# EAGLE design v2.1 Power (EAGLE 9.7.0)
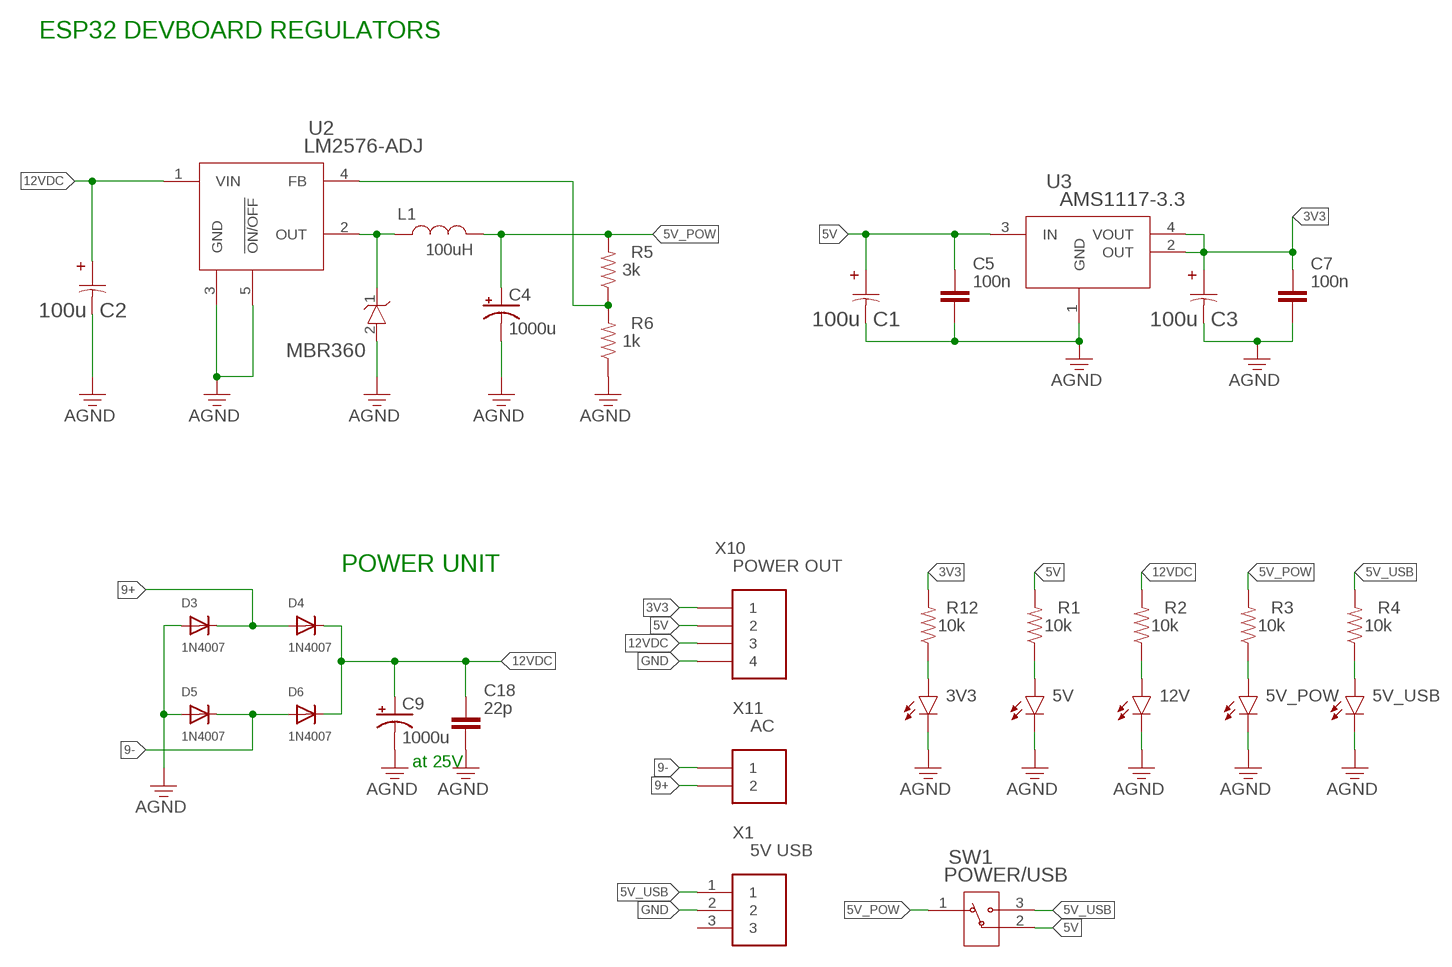
[diagram p0: schematic, sheet 1]

## Parts
3V3  LED  CHIP-FLAT-B_0805  [LEDC2012X110N_FLAT-B]
5V  LED  CHIP-FLAT-B_0805  [LEDC2012X110N_FLAT-B]
5V_POW  LED  CHIP-FLAT-B_0805  [LEDC2012X110N_FLAT-B]
5V_USB  LED  CHIP-FLAT-B_0805  [LEDC2012X110N_FLAT-B]
12V  LED  CHIP-FLAT-B_0805  [LEDC2012X110N_FLAT-B]
C1  100u  100UF_CAPCAP_YX_6P3X11_RUB  [100UF_CAP]
C2  100u  100UF_CAPCAP_YX_6P3X11_RUB  [100UF_CAP]
C3  100u  100UF_CAPCAP_YX_6P3X11_RUB  [100UF_CAP]
C4  1000u  CAP_10X20INCAP_10X20IN  [CAP_10X20IN]
C5  100n  C_CHIP-0805(2012-METRIC)  [CAPC2012X110]
C7  100n  C_CHIP-0805(2012-METRIC)  [CAPC2012X110]
C9  1000u  CAP_10X20INCAP_10X20IN  [CAP_10X20IN]
C18  22p  C_CHIP-0805(2012-METRIC)  [CAPC2012X110]
D3  1N4007  DIODE_SOD-123FL  [SOD-123FL]
D4  1N4007  DIODE_SOD-123FL  [SOD-123FL]
D5  1N4007  DIODE_SOD-123FL  [SOD-123FL]
D6  1N4007  DIODE_SOD-123FL  [SOD-123FL]
L1  100uH  100UH_INDIND_MURATA_2200_MUR  [IND_MURATA_2200_MUR]
MBR360  MBR360RLGDO-201AD_ONS  [DO-201AD_ONS]
R1  10k  R-US_CHIP-0805(2012-METRIC)  [RESC2012X65]
R2  10k  R-US_CHIP-0805(2012-METRIC)  [RESC2012X65]
R3  10k  R-US_CHIP-0805(2012-METRIC)  [RESC2012X65]
R4  10k  R-US_CHIP-0805(2012-METRIC)  [RESC2012X65]
R5  3k  R-US_CHIP-0805(2012-METRIC)  [RESC2012X65]
R6  1k  R-US_CHIP-0805(2012-METRIC)  [RESC2012X65]
R12  10k  R-US_CHIP-0805(2012-METRIC)  [RESC2012X65]
SW1  POWER/USB  SL_SWITCHSS-12D10G5_XKB  [SS-12D10G5_XKB]
U2  LM2576-ADJ  LM2576-ADJT05A_TEX  [T05A_TEX]
U3  AMS1117-3.3  AMS1117-3.3_ADS-L  [_ADS-L]
X1  5V USB  JST-XH-03-PIN-LONG-PAD  [JST-XH-03-PACKAGE-LONG-PAD]
X10  POWER OUT  JST-XH-04-PIN-LONG-PAD  [JST-XH-04-PACKAGE-LONG-PAD]
X11  AC  JST-XH-02-PIN-LONG-PAD  [-LONG-PAD]

## Nets
3V3: C3.1 C7.1 R12.2 U3.2(OUT) U3.4(VOUT) X10.1
5V: C1.1 C5.1 R1.2 SW1.2 U3.3(IN) X10.2
5V_POW: C4.1(+) L1.1 R3.2 R5.2 SW1.1
5V_USB: R4.2 SW1.3 X1.1
9+: D3.C D4.A X11.2
9-: D5.C D6.A X11.1
12VDC: C2.1 C9.1(+) C18.1 D4.C D6.C R2.2 U2.1(VIN) X10.3
FB: R5.1 R6.2 U2.4(FB)
GND: 3V3.C 5V.C 5V_POW.C 5V_USB.C 12V.C C1.2 C2.2 C3.2 C4.2(-) C5.2 C7.2 C9.2(-) C18.2 D3.A D5.A MBR360.2(ANODE) R6.1 U2.3(GND) U2.5(!ON/OFF) U3.1(GND) X1.2 X10.4 ; supply symbol labelled AGND
N$1: 5V.A R1.1
N$2: L1.2 MBR360.1(CATHODE) U2.2(OUT)
N$3: 12V.A R2.1
N$4: 5V_POW.A R3.1
N$5: 5V_USB.A R4.1
N$6: 3V3.A R12.1
Unconnected: X1.3

## Notes on the sheet
- ESP32 DEVBOARD REGULATORS
- POWER UNIT
- at 25V

## Library data of the parts
3V3 5V 5V_POW 5V_USB 12V = LED:CHIP-FLAT-B: Blue LED - Generic; CATEGORY: LED; COLOR: Blue; DESCRIPTION: Blue LED Indication 0805 (2012 Metric); PACKAGE_SIZE: 0805; PACKAGE_TYPE: SMD; SUBCATEGORY: Chip LED; TYPE: Square with Flat Top
C1-C3 = SD-SolderSync-Library:100UF_CAP; COPYRIGHT: Copyright (C) 2025 Ultra Librarian. All rights reserved.; MANUFACTURER_PART_NUMBER: 35ZLH100MEFC6.3X11; MFR_NAME: Rubycon
C4 C9 = SD-SolderSync-Library:CAP_10X20IN; COPYRIGHT: Copyright (C) 2025 Ultra Librarian. All rights reserved.; MANUFACTURER_PART_NUMBER: UVR1E102MPD; MFR_NAME: Nichicon
C5 C7 C18 = Capacitor:C: Capacitor - Generic; CATEGORY: Capacitor; PACKAGE_SIZE: 0805; PACKAGE_TYPE: SMD; SUBCATEGORY: Ceramic Capacitors; TYPE: MLCC
D3-D6 = adafruit:DIODE: Diode SMADIODE - SMA Surface Mount Package 20V 1A Schottky Diode Digikey: 641-1014-6-ND DO-1N4148 - Through Hole Small Current Diode SOD-123 20V 1 A (.5mV Vf) Schottky Diode - Digikey: MBRX120TPMSCT-ND SOD-323 10V 570mA (.38mV Vf, 3ns) Schottky Diode - Digikey: ZLLS410CT-ND SOD-523 30V 30mA Schottky Diode (RB751S-40TE61) - Digikey: RB751S-40TE61CT-ND SOT23-R/W - SOT23 Package (R = Solder Paste/Reflow Ovens, W = Hand-Soldering) BAT54Film 40V 300mA - Digikey: 497-7162-1-ND
L1 = SD-SolderSync-Library:100UH_IND; COPYRIGHT: Copyright (C) 2025 Ultra Librarian. All rights reserved.; MANUFACTURER_PART_NUMBER: 22R104C; MFR_NAME: Murata
MBR360 = SD-SolderSync-Library:MBR360RLG; COPYRIGHT: Copyright (C) 2025 Ultra Librarian. All rights reserved.; MANUFACTURER_PART_NUMBER: MBR360RLG; MFR_NAME: onsemi
R1-R6 R12 = Resistor:R-US: Resistor Fixed - ANSI; CATEGORY: Resistors; DESCRIPTION: Chip Resistor 2.00 X 1.25 X 0.65 mm body 0805(2012-METRIC) Package; PACKAGE_SIZE: 0805; PACKAGE_TYPE: SMD
SW1 = SD-SolderSync-Library:SL_SWITCH; COPYRIGHT: Copyright (C) 2025 Ultra Librarian. All rights reserved.; MANUFACTURER_PART_NUMBER: SS-12D10G5; MFR_NAME: XKB Connectivity
U2 = SD-SolderSync-Library:LM2576-ADJ; COPYRIGHT: Copyright (C) 2025 Ultra Librarian. All rights reserved.; MANUFACTURER_PART_NUMBER: LM2576HVT-ADJ/NOPB; MFR_NAME: Texas Instruments
U3 = SD-SolderSync-Library:AMS1117-3.3; COPYRIGHT: Copyright (C) 2024 Ultra Librarian. All rights reserved.; MANUFACTURER_PART_NUMBER: AMS1117-3.3; MFR_NAME: Advanced Monolithic Systems
X1 = Connectors:JST-XH-03-PIN: JST XH Connector 2 Pin Wire to board connector. Pitch: 2,54 mm, (0.100") Number of pins: 3 Created by Rembrandt Electronics www.rembrandtelectronics.com
X10 = Connectors:JST-XH-04-PIN: JST XH Connector 2 Pin Wire to board connector. Pitch: 2,54 mm, (0.100") Number of pins: 4 Created by Rembrandt Electronics www.rembrandtelectronics.com
X11 = Connectors:JST-XH-02-PIN: JST XH Connector 2 Pin Wire to board connector. Pitch: 2,54 mm, (0.100") Number of pins: 2 Created by Rembrandt Electronics www.rembrandtelectronics.com

## Board
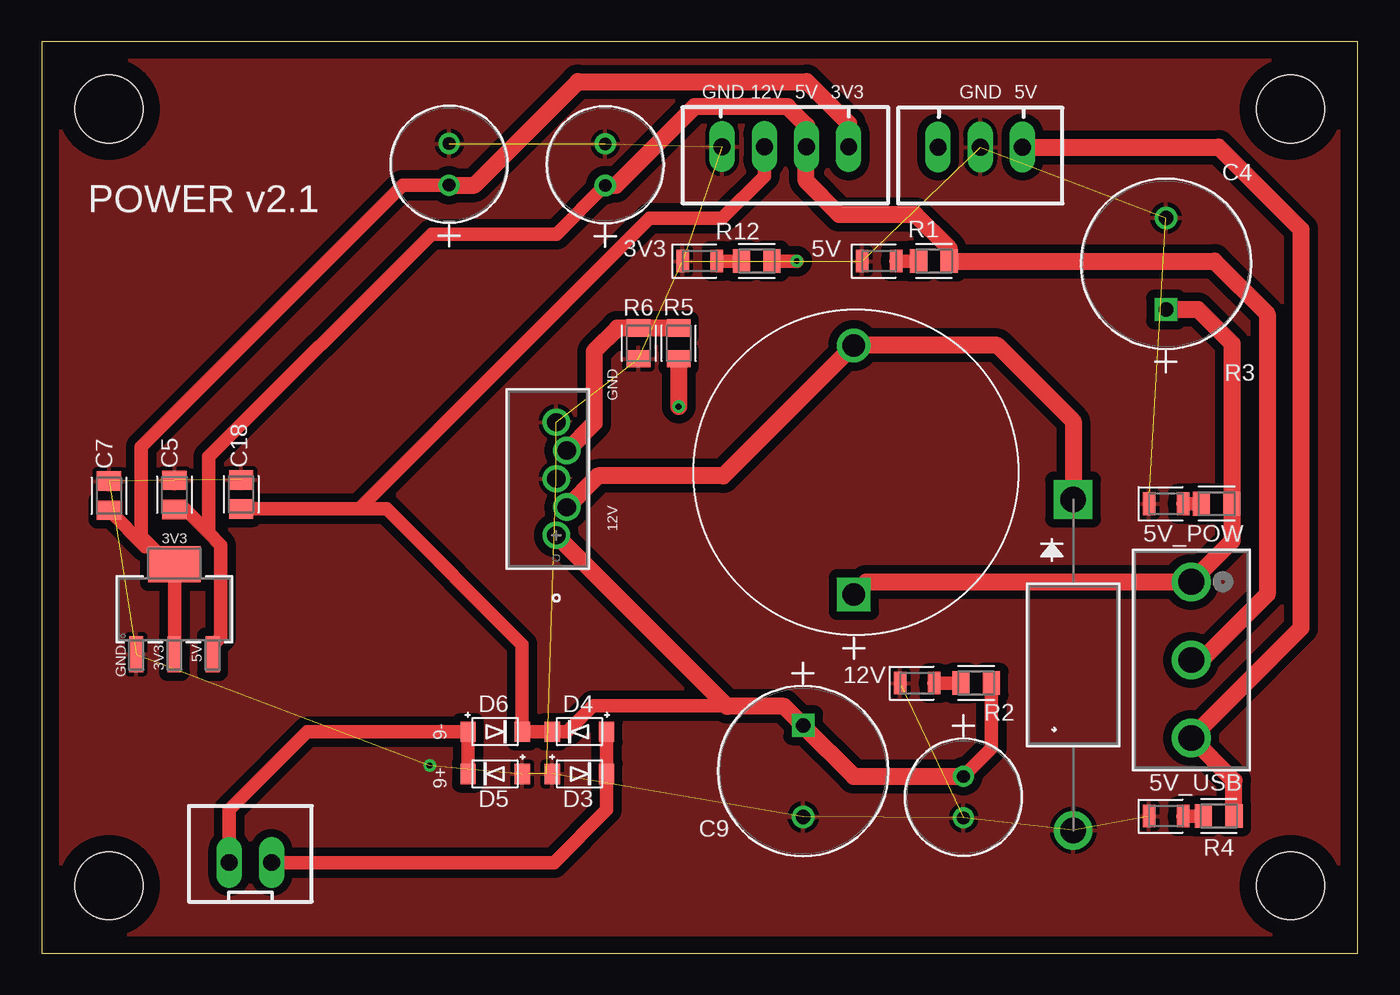
[diagram p1: board, top side]
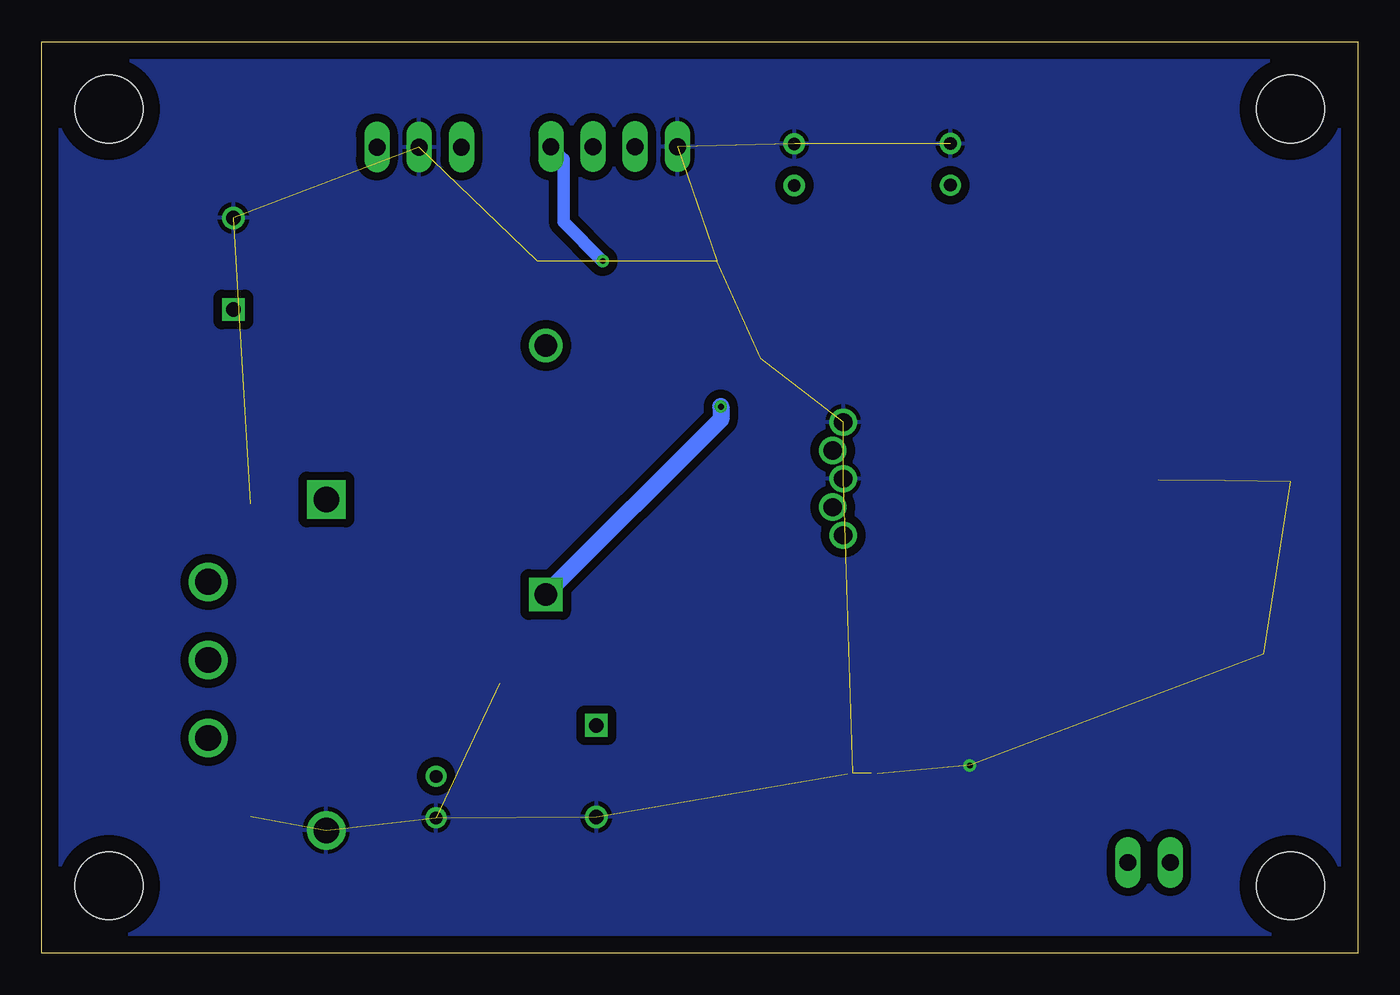
[diagram p2: board, bottom side, seen from below]

Size 79.25 x 54.86 mm. Coordinates in mm from the lower left corner, seen from the top.
Outline: 0,0 79.25,0 79.25,54.86 0,54.86 0,0
Copper layers (1*16): Top 0.035mm / dielectric 1.5mm / Bottom 0.035mm
Design rules "Fusion Electronics Design Rules": minimum track width 6mil, minimum drill 0.35mm, track to track 6mil, track to pad 6mil, pad to pad 6mil, via to via 6mil, smd to smd 6mil, copper to edge 40mil, drill to drill 6mil, minimum pad ring 10mil, minimum via ring 8mil, stop-mask expansion 4mil, vias tented up to drill 0mil, thermal gap 10mil
Holes 4.06 mm at 4.06,4.06 75.18,4.06 4.06,50.8 75.18,50.8

### Footprints (pad centres in the part's own frame; a part is rotated, then mirrored left to right if it is on the bottom)
LEDC2012X110N_FLAT-B = smd 0.762 x 1.362: A 1.025,0; C -1.025,0
100UF_CAP = drill 0.762 pad 1.27: 1 0,0; 2 2.5,0
CAP_10X20IN = drill 0.864 pad 1.372 square: 1 0,0 | drill 0.864 pad 1.372: 2 5.512,0
CAPC2012X110 = smd 1.165 x 1.465: 1 -0.875,0; 2 0.875,0
SOD-123FL = smd 0.91 x 1.22: A 1.637,0; C -1.637,0
IND_MURATA_2200_MUR = drill 1.346 pad 1.854 square: 1 0,0 | drill 1.346 pad 1.854: 2 14.986,0
DO-201AD_ONS = drill 1.549 pad 2.057 square: 1 0,0 | drill 1.549 pad 2.057: 2 19.914,0
RESC2012X65 = smd 1.031 x 1.42: 1 -0.919,0; 2 0.919,0
SS-12D10G5_XKB = drill 1.549 pad 2.057: 1 0,0; 2 4.699,0; 3 9.398,0
T05A_TEX = drill 1.092 pad 1.6: 1 0,0; 2 1.702,-0.635; 3 3.404,0; 4 5.105,-0.635; 5 6.807,0
_ADS-L = smd 0.838 x 2.184: 1 -2.29,-2.705; 2 0,-2.705; 3 2.29,-2.705 | smd 3.15 x 2.184: 4 0,2.705
JST-XH-03-PACKAGE-LONG-PAD = drill 1.016 long: 1 -2.54,0; 2 0,0; 3 2.54,0
JST-XH-04-PACKAGE-LONG-PAD = drill 1.016 long: 1 -3.81,0; 2 -1.27,0; 3 1.27,0; 4 3.81,0
-LONG-PAD = drill 1.016 long: 1 -1.27,0; 2 1.27,0

### Placement (x,y rotation side)
3V3  39.62,41.66 0 top
5V  50.42,41.66 0 top
5V_POW  67.69,27.05 0 top
5V_USB  67.69,8.25 0 top
12V  52.7,16.26 0 top
C1  33.93,46.2 90 top
C2  55.5,10.64 270 top
C3  24.54,46.23 90 top
C4  67.69,38.73 90 top
C5  8,27.58 90 top
C7  4.06,27.53 90 top
C9  45.85,13.72 270 top
C18  12.01,27.61 90 top
D3  32.39,10.8 180 top
D4  32.39,13.34 0 top
D5  27.3,10.8 0 top
D6  27.3,13.34 180 top
L1  48.89,21.59 90 top
MBR360  62.1,27.3 270 top
R1  53.72,41.66 0 top
R2  56.26,16.26 0 top
R3  70.74,27.05 0 top
R4  70.87,8.25 0 top
R5  38.35,36.7 270 top
R6  35.94,36.7 90 top
R12  43.05,41.66 0 top
SW1  69.22,22.35 270 top
U2  30.99,25.15 90 top
U3  8,20.7 0 top
X1  56.52,48.51 180 top
X10  44.78,48.54 180 top
X11  12.57,5.46 0 top

### Tracks (layer width: path | path; a pad name or v marks a point on that pad's centre or on a via)
3V3  (via drill 0.35)
  Top 0.813: U3.2 U3.4 7.7,23.41 6.25,24.86 | 6.25,24.86 5.99,25.11 5.99,30.48 21.74,46.23 C3.1 | C7.1 6.25,24.47 6.25,24.86 | R12.2 v45.47,41.66
  Top 1.016: C3.1 26.06,46.23 32.28,52.45 46.08,52.45 48.59,49.94 X10.1
  Bottom 0.762: X10.1 47.83,47.78 47.83,44.02 v45.47,41.66
5V
  Top 0.813: 10.05,25.29 10.8,24.55 10.8,19.01 10.29,18.5 U3.3 | 10.05,25.29 8.64,26.71 C5.1 | C1.1 31.01,43.28 23.47,43.28 10.05,29.86 10.05,25.29
  Top 1.016: C1.1 34.57,46.2 39.32,50.95 44.91,50.95 46.05,49.81 X10.2 46.03,48.54 46.03,46.49 48.02,44.45 52.61,44.45 54.64,42.42 R1.2 70.61,41.66 73.79,38.48 73.79,21.59 69.85,17.65 SW1.2
5V_POW  (via drill 0.35)
  Top 1.016: C4.1 69.63,38.73 71.66,36.7 R3.2 71.66,24.8 SW1.1 49.66,22.35 L1.1 | R5.2 v38.35,32.89
  Bottom 1.016: v38.35,32.89 38.35,32.13 L1.1
5V_USB
  Top 1.016: R4.2 71.78,10.38 SW1.3 75.82,19.56 75.82,43.56 70.87,48.51 X1.1
9+
  Top 0.813: D4.A D3.C 34.02,8.62 30.86,5.46 X11.2
9-
  Top 0.813: D5.C D6.A 16,13.34 11.3,8.64 X11.1
12VDC
  Top 0.813: C9.1 44.68,14.89 33.19,14.89 31.64,13.34 D4.C D6.C 28.94,18.57 20.78,26.73 C18.1 19.13,26.73 36.61,44.22 40.97,44.22 43.51,46.76 X10.3 | R2.2 57.18,12.32 C2.1
  Top 1.016: C2.1 48.89,10.64 45.85,13.69 C9.1 44.7,14.86 41.28,14.86 U2.1
FB
  Top 1.016: R5.1 R6.2 34.67,37.62 33.27,36.23 33.27,31.9 U2.4
GND  (via drill 0.35)  (22 unrouted)
  Top 0.254: D5.A 29.25,10.8 29.3,10.84 | 30.39,10.84 30.44,10.8 D3.A
  other vias: 23.37,11.3
  pour Top (isolate 0.508): -0.38,-0.38 79.81,-0.38 79.81,55.24 -0.38,55.24
  pour Bottom (isolate 0.508): -0.89,-0.76 80.42,-0.76 80.42,56.01 -0.89,56.01
N$1
  Top 0.813: R1.1 5V.A
N$2
  Top 1.016: U2.2 33.5,28.72 41.04,28.72 L1.2 57.53,36.58 62.1,32 MBR360.1
N$3
  Top 0.813: 12V.A R2.1
N$4
  Top 0.813: 5V_POW.A R3.1
N$5
  Top 0.813: 5V_USB.A R4.1
N$6
  Top 0.813: 3V3.A R12.1

### Text on the board
tPlace: GND | 12V | 5V | 3V3 | GND | 5V | POWER v2.1 | GND | 3V3 | 12V | 5V | GND | 3V3 | 9- | 9+